# EAGLE design LT1013 (EAGLE 9.3.0)
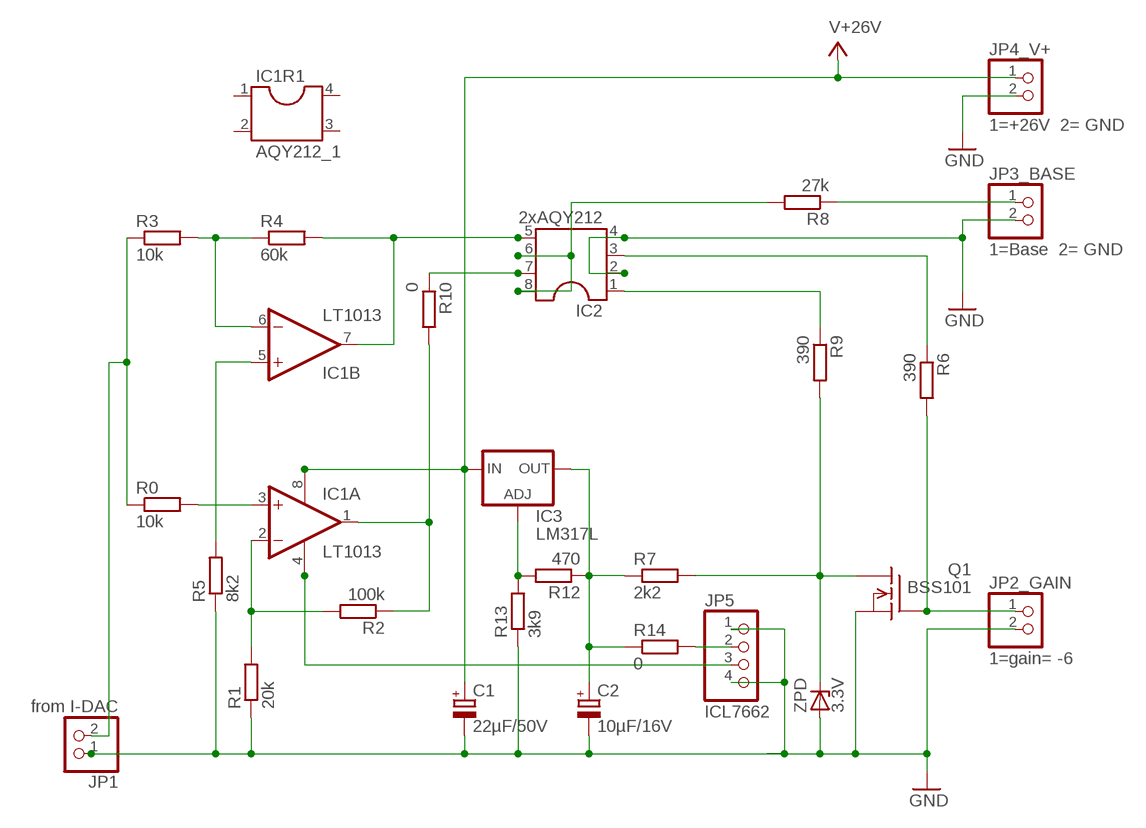
[diagram p0: schematic, sheet 1]

## Parts
C1  22µF/50V  CPOL-EUE5-10.5  [E5-10,5]
C2  10µF/16V  CPOL-EUB45181B  [B45181B]
IC1  LT1013  LF412N  [DIL08]
IC1R1  AQY212_1  DIL4S  [SOCKET-04]
IC2  2xAQY212  DIL8S  [SOCKET-08]
IC3  LM317L  [317L]
JP1  from I-DAC  PINHD-1X2  [1X02]
JP2_GAIN  1=gain= -6  PINHD-1X2  [1X02]
JP3_BASE  1=Base 2= GND  PINHD-1X2  [1X02]
JP4_V+  1=+26V 2= GND  PINHD-1X2  [1X02]
JP5  ICL7662  PINHD-1X4  [1X04]
Q1  BSS101  [TO92]
R0  10k  R-EU_0207/7  [0207/7]
R1  20k  R-EU_0207/7  [0207/7]
R2  100k  R-EU_0207/7  [0207/7]
R3  10k  R-EU_0207/7  [0207/7]
R4  60k  R-EU_0207/7  [0207/7]
R5  8k2  R-EU_0207/7  [0207/7]
R6  390  R-EU_0207/7  [0207/7]
R7  2k2  R-EU_0207/7  [0207/7]
R8  27k  R-EU_0207/7  [0207/7]
R9  390  R-EU_0207/7  [0207/7]
R10  0  R-EU_0207/7  [0207/7]
R12  470  R-EU_0207/7  [0207/7]
R13  3k9  R-EU_0207/7  [0207/7]
R14  0  R-EU_0207/7  [0207/7]
ZPD  3.3V  ZENER-DIODEZD-7.5  [ZDIO-7.5]

## Nets
GND: C1.- C2.- IC2.2 IC2.4 JP1.1 JP2_GAIN.2 JP3_BASE.2 JP4_V+.2 JP5.1 JP5.4 Q1.1(S) R1.1 R5.1 R13.1 ZPD.A
N$1: IC1.6(B:-IN) R3.2 R4.1
N$2: IC1.2(A:-IN) R1.2 R2.2
N$3: IC1.1(A:OUT) R2.1 R10.2
N$4: IC1.3(A:+IN) R0.2
N$5: IC2.1 R9.1
N$6: IC1.7(B:OUT) IC2.5 R4.2
N$7: Q1.3(D) R7.2 R9.2 ZPD.C
N$8: JP5.2 R14.2
N$9: JP3_BASE.1 R8.1
N$10: IC2.6 IC2.8 R8.2
N$11: JP2_GAIN.1 Q1.2(G) R6.2
N$12: JP1.2 R0.1 R3.1
N$13: IC1.5(B:+IN) R5.2
N$14: IC2.3 R6.1
N$15: IC2.7 R10.1
N$18: IC1.4(P:V-) JP5.3
N$19: IC3.1(ADJ) R12.2 R13.2
N$20: C2.+ IC3.2(OUT) R7.1 R12.1 R14.1
V+: C1.+ IC1.8(P:V+) IC3.3(IN) JP4_V+.1 ; supply symbol labelled V+26V
Unconnected: IC1R1.1 IC1R1.2 IC1R1.3 IC1R1.4

## Library data of the parts
C1 = rcl:CPOL-EU: POLARIZED CAPACITOR, European symbol; SPICEPREFIX: C
C2 = resistor:CPOL-EU: POLARIZED CAPACITOR, European symbol
IC1 = linear:LF412: OP AMP
IC1R1 = ic-package:DIL4: Dual In Line / Socket
IC2 = ic-package:DIL8: Dual In Line / Socket
IC3 = v-reg:LM317L: VOLTAGE REGULATOR
JP1 JP2_GAIN JP3_BASE JP4_V+ = pinhead:PINHD-1X2: PIN HEADER
JP5 = pinhead:PINHD-1X4: PIN HEADER
Q1 = transistor-fet:BSS101: N-Channel Enhancement MOSFET 200V; 0,16A; 11Ohm
R0 R1-R10 R12-R14 = rcl:R-EU_: RESISTOR, European symbol; SPICEPREFIX: R
ZPD = diode:ZENER-DIODE: Z-Diode

## Board
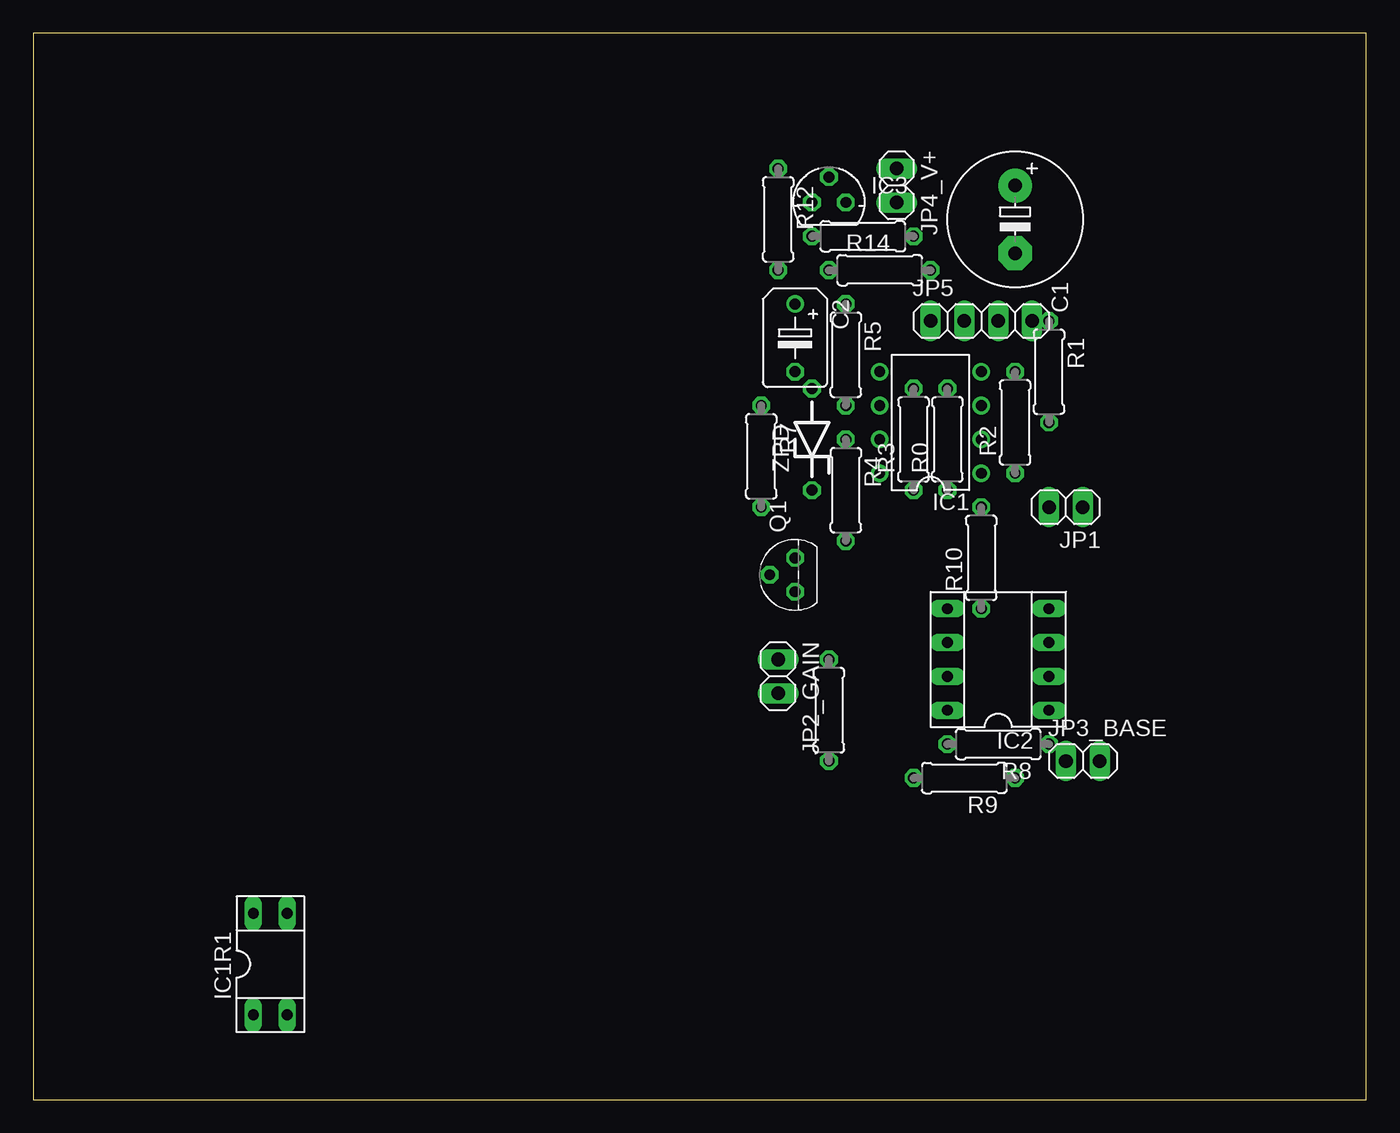
[diagram p1: board, top side]
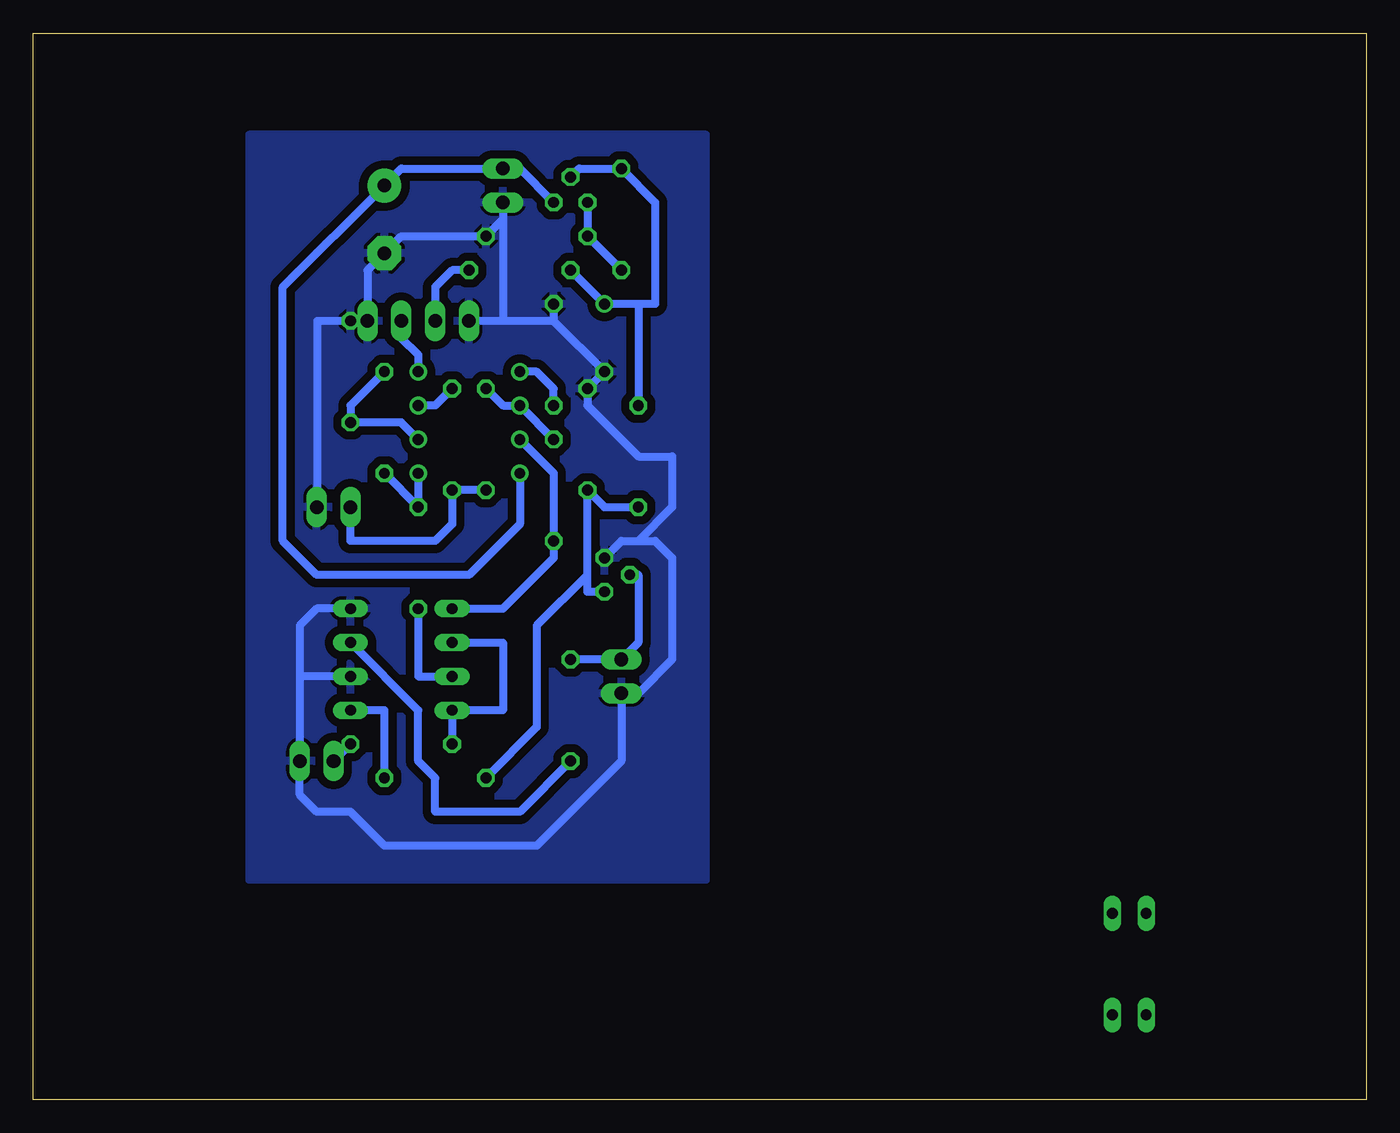
[diagram p2: board, bottom side, seen from below]

Size 100 x 80 mm. Coordinates in mm from the lower left corner, seen from the top.
Outline: 0,0 100,0 100,80 0,80 0,0
Copper layers (1*16): Top 0.035mm / dielectric 1.5mm / Bottom 0.035mm
Design rules "default": minimum track width 6mil, minimum drill 0.35mm, track to track 6mil, track to pad 6mil, pad to pad 6mil, via to via 6mil, smd to smd 6mil, copper to edge 40mil, drill to drill 6mil, minimum pad ring 10mil, minimum via ring 8mil, stop-mask expansion 4mil, vias tented up to drill 0mil, thermal gap 10mil

### Footprints (pad centres in the part's own frame; a part is rotated, then mirrored left to right if it is on the bottom)
E5-10,5 = drill 1.016 pad 2.54: + -2.54,0 | drill 1.016 pad 2.54 octagon: - 2.54,0
B45181B = drill 0.813: + -2.54,0 | drill 0.813 octagon: - 2.54,0
DIL08 = drill 0.813 pad 1.27: 1 -3.81,-3.81; 2 -1.27,-3.81; 3 1.27,-3.81; 4 3.81,-3.81; 5 3.81,3.81; 6 1.27,3.81; 7 -1.27,3.81; 8 -3.81,3.81
SOCKET-04 = drill 0.813 long: 1 -1.27,-3.81; 2 1.27,-3.81; 3 1.27,3.81; 4 -1.27,3.81
SOCKET-08 = drill 0.813 long: 1 -3.81,-3.81; 2 -1.27,-3.81; 3 1.27,-3.81; 4 3.81,-3.81; 5 3.81,3.81; 6 1.27,3.81; 7 -1.27,3.81; 8 -3.81,3.81
317L = drill 0.813 octagon: 1 -1.27,0; 2 0,1.905; 3 1.27,0
1X02 = drill 1.016 long: 1 -1.27,0; 2 1.27,0
1X04 = drill 1.016 long: 1 -3.81,0; 2 -1.27,0; 3 1.27,0; 4 3.81,0
TO92 = drill 0.813 octagon: 1 1.27,0; 2 0,1.905; 3 -1.27,0
0207/7 = drill 0.813 octagon: 1 -3.81,0; 2 3.81,0
ZDIO-7.5 = drill 0.813 octagon: A 3.81,0; C -3.81,0

### Placement (x,y rotation side)
C1  73.66,66.04 270 top
C2  57.15,57.15 270 top
IC1  67.31,50.8 90 top
IC1R1  17.78,10.16 0 top
IC2  72.39,33.02 90 top
IC3  59.69,67.31 0 top
JP1  77.47,44.45 180 top
JP2_GAIN  55.88,31.75 270 top
JP3_BASE  78.74,25.4 0 top
JP4_V+  64.77,68.58 270 top
JP5  71.12,58.42 0 top
Q1  57.15,39.37 90 top
R0  68.58,49.53 90 top
R1  76.2,54.61 270 top
R2  73.66,50.8 90 top
R3  66.04,49.53 90 top
R4  60.96,45.72 270 top
R5  60.96,55.88 270 top
R6  59.69,29.21 90 top
R7  54.61,48.26 270 top
R8  72.39,26.67 180 top
R9  69.85,24.13 180 top
R10  71.12,40.64 90 top
R12  55.88,66.04 270 top
R13  62.23,64.77 180 top
R14  63.5,62.23 0 top
ZPD  58.42,49.53 90 top

### Tracks (layer width: path | path; a pad name or v marks a point on that pad's centre or on a via)
GND
  Bottom 0.61: IC2.2 80.01,31.75 | 80.01,31.75 JP3_BASE.2 80.01,22.86 78.74,21.59 76.2,21.59 73.66,19.05 62.23,19.05 55.88,25.4 JP2_GAIN.2 54.61,30.48 52.07,33.02 52.07,40.64 53.34,41.91 54.61,41.91 | 60.96,58.42 C2.- ZPD.A 58.42,52.07 54.61,48.26 52.07,48.26 52.07,44.45 54.61,41.91 | Q1.1 55.88,41.91 54.61,41.91 | 80.01,31.75 80.01,35.56 78.74,36.83 IC2.4 | JP1.1 78.69,44.48 78.69,58.42 R1.1 JP5.4 74.93,62.23 C1.- 72.39,64.77 R13.1 64.77,66.04 JP4_V+.2 64.77,58.42 | R5.1 60.96,58.42 | 60.96,58.42 64.77,58.42 | 64.77,58.42 JP5.1
  pour Bottom (isolate 0.61): 83.82,72.39 83.82,16.51 49.53,16.51 49.53,72.39
N$1
  Bottom 0.61: R4.1 IC1.6 64.77,52.07 R3.2
N$2
  Bottom 0.61: IC1.2 72.39,50.8 R1.2 76.2,52.07 R2.2
N$3
  Bottom 0.61: IC1.1 R10.2 R2.1
N$4
  Bottom 0.61: R0.2 69.85,52.07 IC1.3
N$5
  Bottom 0.61: R9.1 73.66,29.21 IC2.1
N$6
  Bottom 0.61: IC1.7 60.96,46.99 R4.2 60.96,40.64 64.77,36.83 IC2.5
N$7
  Bottom 0.61: R7.2 57.15,44.45 ZPD.C 58.42,39.37 | 58.42,39.37 58.42,38.1 Q1.3 | 58.42,39.37 62.23,35.56 62.23,27.94 R9.2
N$8
  Bottom 0.61: R14.2 68.58,62.23 69.85,60.96 JP5.2
N$9
  Bottom 0.61: JP3_BASE.1 R8.1
N$10
  Bottom 0.61: R8.2 IC2.8 64.77,29.21 64.77,34.29 IC2.6
N$11
  Bottom 0.61: Q1.2 54.61,39.37 54.61,34.29 JP2_GAIN.1 R6.2
N$12
  Bottom 0.61: R3.1 R0.1 68.58,43.18 69.85,41.91 76.2,41.91 JP1.2
N$13
  Bottom 0.61: R5.2 60.96,53.34 62.23,54.61 IC1.5
N$14
  Bottom 0.61: IC2.3 71.12,29.21 71.12,25.4 69.85,24.13 69.85,21.59 63.5,21.59 R6.1
N$15
  Bottom 0.61: R10.1 71.12,31.75 IC2.7
N$18
  Bottom 0.61: JP5.3 72.39,57.15 71.12,55.88 IC1.4
N$19
  Bottom 0.61: IC3.1 R13.2 R12.2
N$20
  Bottom 0.61: IC3.2 59.05,69.85 R12.1 53.34,67.31 53.34,59.69 54.61,59.69 | 54.61,59.69 C2.+ R14.1 | 54.61,59.69 R7.1
V+
  Bottom 0.61: IC1.8 63.5,43.18 67.31,39.37 78.74,39.37 81.28,41.91 81.28,60.96 C1.+ 72.39,69.85 JP4_V+.1 63.5,69.85 IC3.3